# Altium project USB2JTAG.PrjPcb
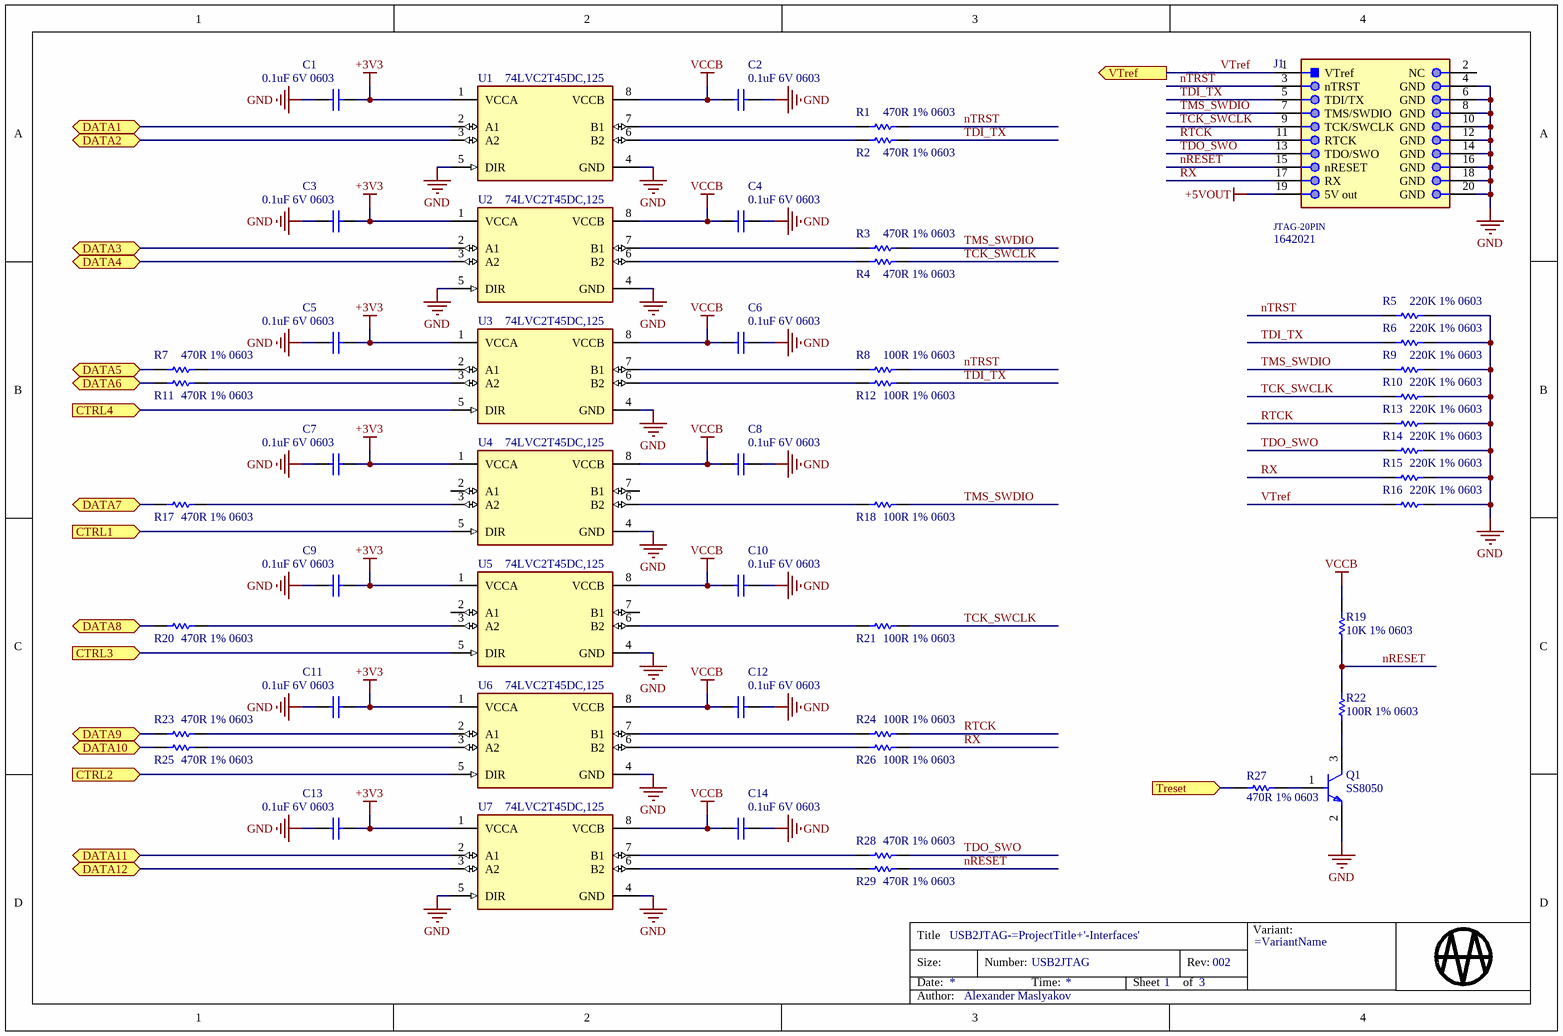
[diagram p0: USB2JTAG-Interfaces.SchDoc]
CompanyTitle: KS2Corp; PCB-SurfaceFinish: HASL; ProjectAuthor: Alexander Maslyakov; ProjectPartNumber: USB2JTAG; ProjectRevision: 002; ProjectTitle: USB2JTAG
3 sheets, 108 parts. Net scope: flat (ports and power ports of the same name join across sheets).
Board file: USB2JTAG.PcbDoc
Sheets:
  USB2JTAG-Interfaces.SchDoc
  USB2JTAG-MCU.SchDoc
  USB2JTAG-Power.SchDoc

## Sheet USB2JTAG-Interfaces.SchDoc: =ProjectTitle+'-Interfaces'
size A4; DocumentNumber: USB2JTAG; Revision: 002; SheetNumber: 1; SheetTotal: 3

### Parts
(Parts that share a designator on the sheet are numbered #1, #2 ... from top to bottom, then left to right.)
?#1  Sheet Title: USB2JTAG-=ProjectTitle+'-Interfaces'  Document Number: USB2JTAG  Revision Number: 002  Document Path and Name: Alexander Maslyakov  Total Sheets: 3  Sheet Number: 1  (hidden comment: Title Block Logo)  (graphical)
C1  0.1uF 6V 0603  [FP-GRM188-0_1-e0_2_0_55-IPC_C-NOSILK]
C2  0.1uF 6V 0603  [FP-GRM188-0_1-e0_2_0_55-IPC_C-NOSILK]
C3  0.1uF 6V 0603  [FP-GRM188-0_1-e0_2_0_55-IPC_C-NOSILK]
C4  0.1uF 6V 0603  [FP-GRM188-0_1-e0_2_0_55-IPC_C-NOSILK]
C5  0.1uF 6V 0603  [FP-GRM188-0_1-e0_2_0_55-IPC_C-NOSILK]
C6  0.1uF 6V 0603  [FP-GRM188-0_1-e0_2_0_55-IPC_C-NOSILK]
C7  0.1uF 6V 0603  [FP-GRM188-0_1-e0_2_0_55-IPC_C-NOSILK]
C8  0.1uF 6V 0603  [FP-GRM188-0_1-e0_2_0_55-IPC_C-NOSILK]
C9  0.1uF 6V 0603  [FP-GRM188-0_1-e0_2_0_55-IPC_C-NOSILK]
C10  0.1uF 6V 0603  [FP-GRM188-0_1-e0_2_0_55-IPC_C-NOSILK]
C11  0.1uF 6V 0603  [FP-GRM188-0_1-e0_2_0_55-IPC_C-NOSILK]
C12  0.1uF 6V 0603  [FP-GRM188-0_1-e0_2_0_55-IPC_C-NOSILK]
C13  0.1uF 6V 0603  [FP-GRM188-0_1-e0_2_0_55-IPC_C-NOSILK]
C14  0.1uF 6V 0603  [FP-GRM188-0_1-e0_2_0_55-IPC_C-NOSILK]
J1  JTAG-20PIN  Supplier Part Number 1: 1642021  [61202021621-Edge-SMT]
Q1  SS8050  [FP-SS8050-G-IPC_B]
R1  470R 1% 0603  [FP-ERA3A-IPC_C-NOSILK]
R2  470R 1% 0603  [FP-ERA3A-IPC_C-NOSILK]
R3  470R 1% 0603  [FP-ERA3A-IPC_C-NOSILK]
R4  470R 1% 0603  [FP-ERA3A-IPC_C-NOSILK]
R5  220K 1% 0603  [FP-ERA3A-IPC_C-NOSILK]
R6  220K 1% 0603  [FP-ERA3A-IPC_C-NOSILK]
R7  470R 1% 0603  [FP-ERA3A-IPC_C-NOSILK]
R8  100R 1% 0603  [FP-ERA3A-IPC_C-NOSILK]
R9  220K 1% 0603  [FP-ERA3A-IPC_C-NOSILK]
R10  220K 1% 0603  [FP-ERA3A-IPC_C-NOSILK]
R11  470R 1% 0603  [FP-ERA3A-IPC_C-NOSILK]
R12  100R 1% 0603  [FP-ERA3A-IPC_C-NOSILK]
R13  220K 1% 0603  [FP-ERA3A-IPC_C-NOSILK]
R14  220K 1% 0603  [FP-ERA3A-IPC_C-NOSILK]
R15  220K 1% 0603  [FP-ERA3A-IPC_C-NOSILK]
R16  220K 1% 0603  [FP-ERA3A-IPC_C-NOSILK]
R17  470R 1% 0603  [FP-ERA3A-IPC_C-NOSILK]
R18  100R 1% 0603  [FP-ERA3A-IPC_C-NOSILK]
R19  10K 1% 0603  [FP-ERA3A-IPC_C-NOSILK]
R20  470R 1% 0603  [FP-ERA3A-IPC_C-NOSILK]
R21  100R 1% 0603  [FP-ERA3A-IPC_C-NOSILK]
R22  100R 1% 0603  [FP-ERA3A-IPC_C-NOSILK]
R23  470R 1% 0603  [FP-ERA3A-IPC_C-NOSILK]
R24  100R 1% 0603  [FP-ERA3A-IPC_C-NOSILK]
R25  470R 1% 0603  [FP-ERA3A-IPC_C-NOSILK]
R26  100R 1% 0603  [FP-ERA3A-IPC_C-NOSILK]
R27  470R 1% 0603  [FP-ERA3A-IPC_C-NOSILK]
R28  470R 1% 0603  [FP-ERA3A-IPC_C-NOSILK]
R29  470R 1% 0603  [FP-ERA3A-IPC_C-NOSILK]
U1  74LVC2T45DC,125  [FP-DCU0008A-MFG]
U2  74LVC2T45DC,125  [FP-DCU0008A-MFG]
U3  74LVC2T45DC,125  [FP-DCU0008A-MFG]
U4  74LVC2T45DC,125  [FP-DCU0008A-MFG]
U5  74LVC2T45DC,125  [FP-DCU0008A-MFG]
U6  74LVC2T45DC,125  [FP-DCU0008A-MFG]
U7  74LVC2T45DC,125  [FP-DCU0008A-MFG]

### Ports
CTRL1 (in), CTRL2 (in), CTRL3 (in), CTRL4 (in), DATA1 (bidir), DATA2 (bidir), DATA3 (bidir), DATA4 (bidir), DATA5 (bidir), DATA6 (bidir), DATA7 (bidir), DATA8 (bidir), DATA9 (bidir), DATA10 (bidir), DATA11 (bidir), DATA12 (bidir), Treset (in), VTref (out)

### Nets
+3V3: C1.1 C3.1 C5.1 C7.1 C9.1 C11.1 C13.1 U1.1(VCCA) U2.1(VCCA) U3.1(VCCA) U4.1(VCCA) U5.1(VCCA) U6.1(VCCA) U7.1(VCCA)
+5VOUT: J1.19(5V_out)
GND: C1.2 C2.1 C3.2 C4.1 C5.2 C6.1 C7.2 C8.1 C9.2 C10.1 C11.2 C12.1 C13.2 C14.1 J1.4(GND) J1.6(GND) J1.8(GND) J1.10(GND) J1.12(GND) J1.14(GND) J1.16(GND) J1.18(GND) J1.20(GND) Q1.2(E) R5.2 R6.2 R9.2 R10.2 R13.2 R14.2 R15.2 R16.2 U1.4(GND) U1.5(DIR) U2.4(GND) U2.5(DIR) U3.4(GND) U4.4(GND) U5.4(GND) U6.4(GND) U7.4(GND) U7.5(DIR)
VCCB: C2.2 C4.2 C6.2 C8.2 C10.2 C12.2 C14.2 R19.1 U1.8(VCCB) U2.8(VCCB) U3.8(VCCB) U4.8(VCCB) U5.8(VCCB) U6.8(VCCB) U7.8(VCCB)
DATA1: U1.2(A1) ; port DATA1
DATA2: U1.3(A2) ; port DATA2
DATA3: U2.2(A1) ; port DATA3
DATA4: U2.3(A2) ; port DATA4
DATA5: R7.1 ; port DATA5
DATA6: R11.1 ; port DATA6
DATA7: R17.1 ; port DATA7
DATA8: R20.1 ; port DATA8
DATA9: R23.1 ; port DATA9
DATA10: R25.1 ; port DATA10
DATA11: U7.2(A1) ; port DATA11
DATA12: U7.3(A2) ; port DATA12
nRESET: J1.15(nRESET) R19.2 R22.1 R29.2
nTRST: J1.3(nTRST) R1.2 R5.1 R8.2
RTCK: J1.11(RTCK) R13.1 R24.2
RX: J1.17(RX) R15.1 R26.2
TCK_SWCLK: J1.9(TCK/SWCLK) R4.2 R10.1 R21.2
TDI_TX: J1.5(TDI/TX) R2.2 R6.1 R12.2
TDO_SWO: J1.13(TDO/SWO) R14.1 R28.2
TMS_SWDIO: J1.7(TMS/SWDIO) R3.2 R9.1 R18.2
VTref: J1.1(VTref) R16.1 ; port VTref
NetQ1_1: Q1.1(B) R27.1
NetQ1_3: Q1.3(C) R22.2
NetR1_1: R1.1 U1.7(B1)
NetR2_1: R2.1 U1.6(B2)
NetR3_1: R3.1 U2.7(B1)
NetR4_1: R4.1 U2.6(B2)
NetR7_2: R7.2 U3.2(A1)
NetR8_1: R8.1 U3.7(B1)
NetR11_2: R11.2 U3.3(A2)
NetR12_1: R12.1 U3.6(B2)
NetR17_2: R17.2 U4.3(A2)
NetR18_1: R18.1 U4.6(B2)
NetR20_2: R20.2 U5.3(A2)
NetR21_1: R21.1 U5.6(B2)
NetR23_2: R23.2 U6.2(A1)
NetR24_1: R24.1 U6.7(B1)
NetR25_2: R25.2 U6.3(A2)
NetR26_1: R26.1 U6.6(B2)
NetR27_2: R27.2 ; port Treset
NetR28_1: R28.1 U7.7(B1)
NetR29_1: R29.1 U7.6(B2)
NetU3_5: U3.5(DIR) ; port CTRL4
NetU4_5: U4.5(DIR) ; port CTRL1
NetU5_5: U5.5(DIR) ; port CTRL3
NetU6_5: U6.5(DIR) ; port CTRL2

Not connected (* = marked no-connect by the designer): J1 2(NC); U4 2(A1) 7(B1); U5 2(A1) 7(B1)

### Notes on the sheet
- Title
- Size:
- Date:
- A4
- Number:
- Time:
- Revision:
- Sheet
- of
- File:
- (in symbol Title Block MAA) Variant:; Title; Size:; Number:; Rev:; Date:; Time:; Sheet; of; Author:

### Library data of the parts
?#1 = Title Block MAA: Organization Address 1: =VariantName; Date: *; Time: *
C1-C14 = CAP0603: 50V 100nF X7R ±5% 0603 Multilayer Ceramic Capacitors MLCC - SMD/SMT ROHS; Manufacturer: Walsin Tech Corp; Manufacturer Part Number: 0603B104J500CT; Supplier 1: LCSC; Supplier Part Number 1: C119027; Case/Package: 0603
  C2: ComponentLink1Description: Datasheet; ComponentLink1URL: https://datasheet.lcsc.com/lcsc/1811151131_Walsin-Tech-Corp-0603B104J500CT_C119027.pdf
J1 = JTAG-20PIN: Male Box Header WR-BHD, THT, Vertical, pitch 2.54 mm, 20 pins; Manufacturer: Wurth Elektronik; Part Number: 61202021621; Contact Resistance: 20mOhm; Withstanding Voltage: 500VAC; Pitch: 2.54mm; Pin Number: 20; Working Voltage: 250VAC; Current Rating: 3A; Voltage Rating: 250V; Insulation Resistance: 1GR; Connector Type: Male Pin; Insulation: Insulated; Row Spacing: 0.1inch; Orientation: Vertical; Package Reference: 61202021621; Publisher: WurthElektronik; Datasheet URL: https://katalog.we-online.de/em/datasheet/6120xx21621.pdf; Operating Temperature: -40to125degC; Packaging: Tray; Mounting Technology: THT; Gender: Male; Manufacturer URL: http://www.we-online.de; Published Date: August2018; Supplier 1: Farnell; Manufacturer Part Number: 61202021621; RoHS: Yes; Category: Headers and Wire Housings; Stock 1: 1948; Pricing 1: 1=0,93000, 10=0,84200, 100=0,66700, 500=0,65400, 1000=0,64000, 2500=0,62700 (EUR); Mount: Through Hole; Contact Plating: Gold; Contact Material: Copper Alloy,Copper; Color: Black; Housing Material: PBT; Min Operating Temperature: -40°C; Max Operating Temperature: 125°C; Number of Rows: 2; Package Quantity: 160; Contact Gender: Male; Number of Positions: 20; Termination: Through Hole; Number of Contacts: 20; Series: WR-BHD; Contact Type: Male Pin; Length: 33.06mm; Width: 33.06mm; Height: 8.85mm; REACH SVHC: Unknown; Flammability Rating: UL94 V-0; RoHS Compliant: Yes; ComponentLink1URL: https://datasheet.ciiva.com/731/6120xx21621-731346.pdf?src-supplier=Digi-Key; ComponentLink1Description: https://datasheet.ciiva.com/731/6120xx21621-731346.pdf?src-supplier=Digi-Key
Q1 = CMP-20235-000001-1: 100nA 25V 300mW 1.5A 200@100mA,1V 100MHz 500mV@800mA,80mA NPN +150℃@(Tj) SOT-23(SOT-23-3) Bipolar Transistors - BJT ROHS; Manufacturer: JCST; Case/Package: SOT-23-3; Supplier 1: LCSC; Supplier Part Number 1: C2150; Manufacturer Part Number: SS8050; ComponentLink1Description: datasheet; ComponentLink1URL: https://datasheet.lcsc.com/lcsc/1811052004_Jiangsu-Changjing-Electronics-Technology-Co---Ltd--SS8050_C2150.pdf
R1-R4 R7 R11 R17 R20 R23 R25 R27-R29 = RES0603: 100mW 75V ±100ppm/℃ ±1% -55℃~+155℃ 470Ω 0603 Chip Resistor - Surface Mount ROHS; Manufacturer: YAGEO; Manufacturer Part Number: RC0603FR-07470RL; Case/Package: 0603; Supplier 1: LCSC; Supplier Part Number 1: C114669
  R1: ComponentLink1Description: Datasheet; ComponentLink1URL: https://datasheet.lcsc.com/lcsc/1810161617_YAGEO-RC0603FR-07470RL_C114669.pdf
R5 R6 R9 R10 R13-R16 = RES0603: 100mW Thick Film Resistors 75V ±100ppm/℃ ±1% -55℃~+155℃ 220kΩ 0603 Chip Resistor - Surface Mount ROHS; Manufacturer: UNI-ROYAL(Uniroyal Elec); Manufacturer Part Number: 0603WAF2203T5E; Case/Package: 0603; Supplier 1: LCSC; Supplier Part Number 1: C22961
  R5: ComponentLink1Description: Datasheet; ComponentLink1URL: https://datasheet.lcsc.com/lcsc/2206010130_UNI-ROYAL-Uniroyal-Elec-0603WAF2203T5E_C22961.pdf
R8 R12 R18 R21 R22 R24 R26 = RES0603: 100mW Thick Film Resistors 75V ±1% ±100ppm/℃ 100Ω -55℃~+155℃ 0603 Chip Resistor - Surface Mount ROHS; Manufacturer: YAGEO; Manufacturer Part Number: RC0603FR-07100RL; Case/Package: 0603; Supplier 1: LCSC; Supplier Part Number 1: C105588
  R8: ComponentLink1Description: Datasheet; ComponentLink1URL: https://datasheet.lcsc.com/lcsc/1810231425_YAGEO-RC0603FR-07100RL_C105588.pdf
R19 = RES0603: 0.1W ±1% 10kΩ 0603 Chip Resistor - Surface Mount ROHS; Manufacturer: TyoHM; Manufacturer Part Number: RMC 0603 10K F N; Case/Package: 0603; Supplier 1: LCSC; Supplier Part Number 1: C269701; ComponentLink1Description: Datasheet; ComponentLink1URL: https://datasheet.lcsc.com/lcsc/1811101830_TyoHM-RMC-0603-10K-F-N_C269701.pdf
U1-U7 = 74LVC2T45DC: 1.2V~5.5V Tri-State，Unidirectional Voltage Level Translators -40℃~+125℃ 1.2V~5.5V Bi-Directional Voltage Levels 1 2 420Mbps VSSOP-8 Translators / Level Shifters ROHS; Manufacturer: Nexperia; Manufacturer Part Number: 74LVC2T45DC,125; Supplier 1: LCSC; Supplier Part Number 1: C730237; ComponentLink1Description: Datasheet; ComponentLink1URL: https://datasheet.lcsc.com/lcsc/2201131100_Nexperia-74LVC2T45DC-125_C730237.pdf; Case/Package: VSSOP-8

## Sheet USB2JTAG-MCU.SchDoc: =ProjectTitle+'-MCU'
size A4; DocumentNumber: USB2JTAG; Revision: 002; SheetNumber: 2; SheetTotal: 3
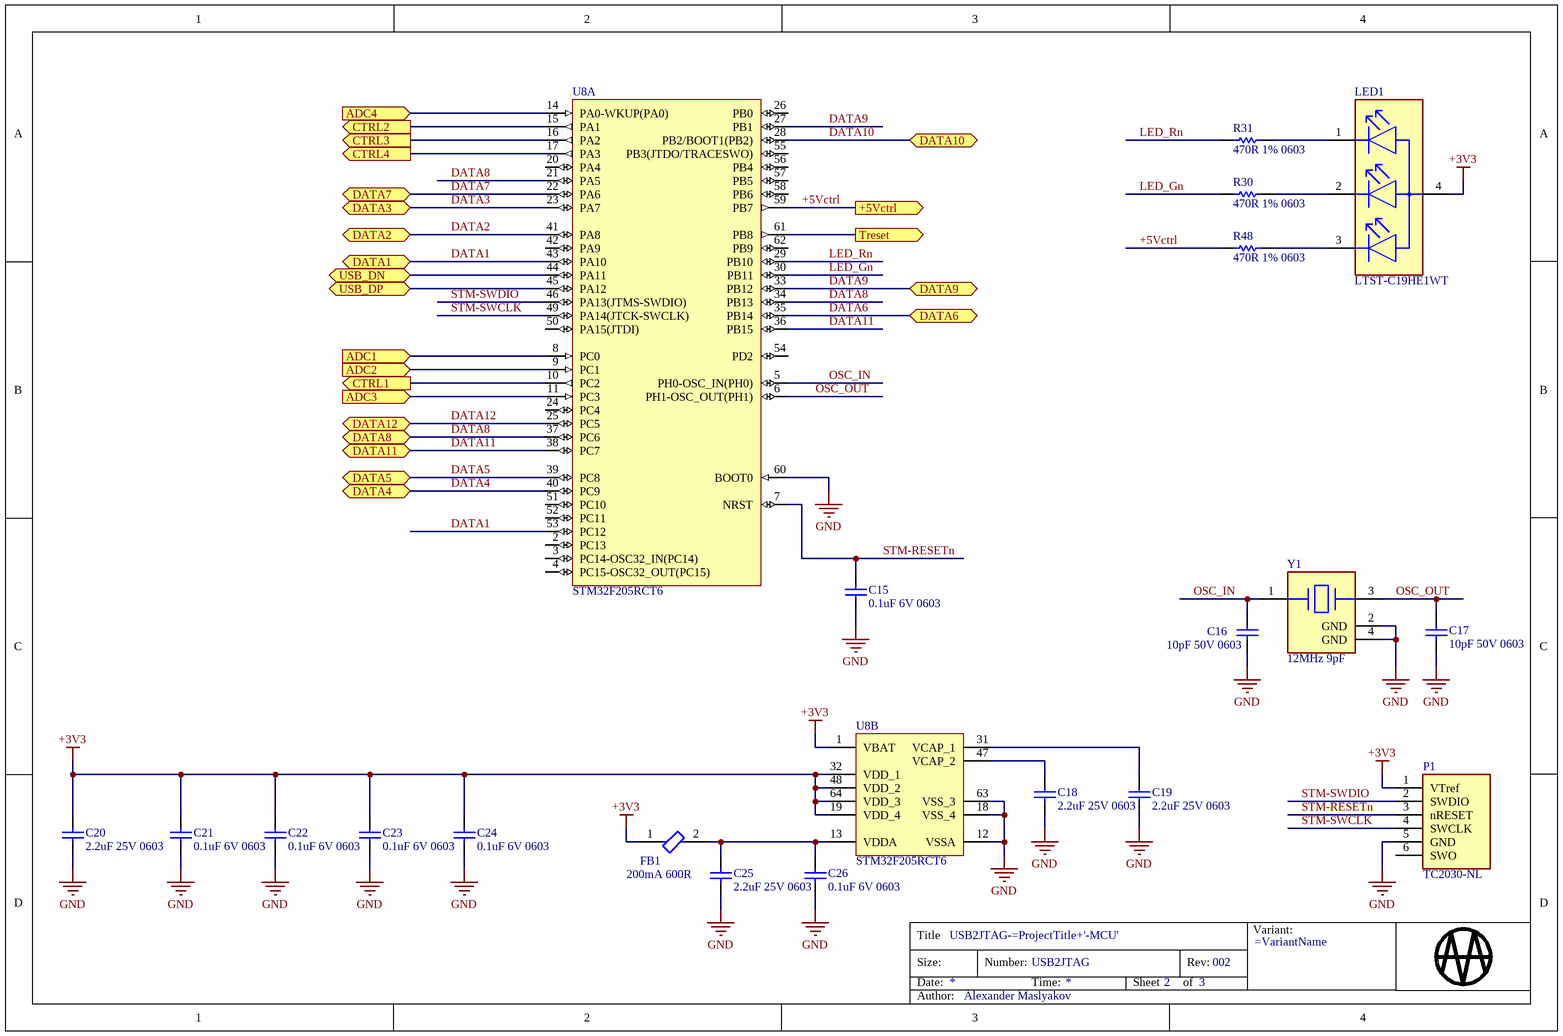
[diagram p1: USB2JTAG-MCU.SchDoc]

### Parts
(Parts that share a designator on the sheet are numbered #1, #2 ... from top to bottom, then left to right.)
?#2  Sheet Title: USB2JTAG-=ProjectTitle+'-MCU'  Document Number: USB2JTAG  Revision Number: 002  Document Path and Name: Alexander Maslyakov  Total Sheets: 3  Sheet Number: 2  (hidden comment: Title Block Logo)  (graphical)
C15  0.1uF 6V 0603  [FP-GRM188-0_1-e0_2_0_55-IPC_C-NOSILK]
C16  10pF 50V 0603  [FP-GRM188-0_1-e0_2_0_55-IPC_C-NOSILK]
C17  10pF 50V 0603  [FP-GRM188-0_1-e0_2_0_55-IPC_C-NOSILK]
C18  2.2uF 25V 0603  [FP-GRM188-0_1-e0_2_0_55-IPC_C-NOSILK]
C19  2.2uF 25V 0603  [FP-GRM188-0_1-e0_2_0_55-IPC_C-NOSILK]
C20  2.2uF 25V 0603  [FP-GRM188-0_1-e0_2_0_55-IPC_C-NOSILK]
C21  0.1uF 6V 0603  [FP-GRM188-0_1-e0_2_0_55-IPC_C-NOSILK]
C22  0.1uF 6V 0603  [FP-GRM188-0_1-e0_2_0_55-IPC_C-NOSILK]
C23  0.1uF 6V 0603  [FP-GRM188-0_1-e0_2_0_55-IPC_C-NOSILK]
C24  0.1uF 6V 0603  [FP-GRM188-0_1-e0_2_0_55-IPC_C-NOSILK]
C25  2.2uF 25V 0603  [FP-GRM188-0_1-e0_2_0_55-IPC_C-NOSILK]
C26  0.1uF 6V 0603  [FP-GRM188-0_1-e0_2_0_55-IPC_C-NOSILK]
FB1  200mA 600R  [FP-BLM18-0_15-t0_8-IPC_C]
LED1  LTST-C19HE1WT  [FP-LTST-C19HE1WT-MFG]
P1  TC2030-NL  [TC2030-NL]  (no BOM)
R30  470R 1% 0603  [FP-ERA3A-IPC_C-NOSILK]
R31  470R 1% 0603  [FP-ERA3A-IPC_C-NOSILK]
R48  470R 1% 0603  [FP-ERA3A-IPC_C-NOSILK]
U8  STM32F205RCT6  [STM-LQFP64_V]  (parts A,B of 2)
Y1  12MHz 9pF  [FP-TSX-3225-MFG]

### Ports
+5Vctrl (out), ADC1 (in), ADC2 (in), ADC3 (in), ADC4 (in), CTRL1 (out), CTRL2 (out), CTRL3 (out), CTRL4 (out), DATA1 (bidir), DATA2 (bidir), DATA3 (bidir), DATA4 (bidir), DATA5 (bidir), DATA6 (bidir), DATA7 (bidir), DATA8 (bidir), DATA9 (bidir), DATA10 (bidir), DATA11 (bidir), DATA12 (bidir), Treset (out), USB_DN (bidir), USB_DP (bidir)

### Nets
+3V3: C20.1 C21.1 C22.1 C23.1 C24.1 FB1.1 LED1.4(A) P1.1(VTref) U8.1(VBAT) U8.19(VDD_4) U8.32(VDD_1) U8.48(VDD_2) U8.64(VDD_3)
GND: C15.2 C16.2 C17.2 C18.2 C19.2 C20.2 C21.2 C22.2 C23.2 C24.2 C25.2 C26.2 P1.5(GND) U8.12(VSSA) U8.18(VSS_4) U8.60(BOOT0) U8.63(VSS_3) Y1.2(GND) Y1.4(GND)
+5Vctrl: R48.1 U8.59(PB7) ; port +5Vctrl
DATA1: U8.43(PA10) U8.53(PC12) ; port DATA1
DATA2: U8.41(PA8) ; port DATA2
DATA3: U8.23(PA7) ; port DATA3
DATA4: U8.40(PC9) ; port DATA4
DATA5: U8.39(PC8) ; port DATA5
DATA6: U8.35(PB14) ; port DATA6
DATA7: U8.22(PA6) ; port DATA7
DATA8: U8.21(PA5) U8.34(PB13) U8.37(PC6) ; port DATA8
DATA9: U8.27(PB1) U8.33(PB12) ; port DATA9
DATA10: U8.28(PB2/BOOT1(PB2)) ; port DATA10
DATA11: U8.36(PB15) U8.38(PC7) ; port DATA11
DATA12: U8.25(PC5) ; port DATA12
LED_Gn: R30.1 U8.30(PB11)
LED_Rn: R31.1 U8.29(PB10)
OSC_IN: C16.1 U8.5(PH0-OSC_IN(PH0)) Y1.1
OSC_OUT: C17.1 U8.6(PH1-OSC_OUT(PH1)) Y1.3
STM-RESETn: C15.1 P1.3(nRESET) U8.7(NRST)
STM-SWCLK: P1.4(SWCLK) U8.49(PA14(JTCK-SWCLK))
STM-SWDIO: P1.2(SWDIO) U8.46(PA13(JTMS-SWDIO))
USB_D_N: U8.44(PA11) ; port USB_DN
USB_D_P: U8.45(PA12) ; port USB_DP
NetC18_1: C18.1 U8.47(VCAP_2)
NetC19_1: C19.1 U8.31(VCAP_1)
NetC25_1: C25.1 C26.1 FB1.2 U8.13(VDDA)
NetC30_1: U8.8(PC0) ; port ADC1
NetC31_1: U8.11(PC3) ; port ADC3
NetC32_1: U8.14(PA0-WKUP(PA0)) ; port ADC4
NetC34_1: U8.9(PC1) ; port ADC2
NetLED1_1: LED1.1(RED_C) R31.2
NetLED1_2: LED1.2(GREEN_C) R30.2
NetLED1_3: LED1.3(BLUE_C) R48.2
NetR27_2: U8.61(PB8) ; port Treset
NetU3_5: U8.17(PA3) ; port CTRL4
NetU4_5: U8.10(PC2) ; port CTRL1
NetU5_5: U8.16(PA2) ; port CTRL3
NetU6_5: U8.15(PA1) ; port CTRL2

Not connected (* = marked no-connect by the designer): P1 6(SWO); U8 2(PC13) 3(PC14-OSC32_IN(PC14)) 4(PC15-OSC32_OUT(PC15)) 20(PA4) 24(PC4) 26(PB0) 42(PA9) 50(PA15(JTDI)) 51(PC10) 52(PC11) 54(PD2) 55(PB3(JTDO/TRACESWO)) 56(PB4) 57(PB5) 58(PB6) 62(PB9)

### Notes on the sheet
- Title
- Size:
- Date:
- A4
- Number:
- Time:
- Revision:
- Sheet
- of
- File:
- (in symbol Title Block MAA) Variant:; Title; Size:; Number:; Rev:; Date:; Time:; Sheet; of; Author:

### Library data of the parts
?#2 = Title Block MAA: Organization Address 1: =VariantName; Date: *; Time: *
C15 C21-C24 C26 = CAP0603: as C1 on sheet USB2JTAG-Interfaces; Supplier 1: LCSC; Supplier Part Number 1: C119027; Case/Package: 0603
  C26: ComponentLink1Description: Datasheet; ComponentLink1URL: https://datasheet.lcsc.com/lcsc/1811151131_Walsin-Tech-Corp-0603B104J500CT_C119027.pdf
C16 C17 = CAP0603: 50V 10pF C0G ±5% 0603 Multilayer Ceramic Capacitors MLCC - SMD/SMT ROHS; Manufacturer: FH(Guangdong Fenghua Advanced Tech); Manufacturer Part Number: 0603CG100J500NT; Supplier 1: LCSC; Supplier Part Number 1: C91367; Case/Package: 0603
  C16: ComponentLink1Description: Datasheet; ComponentLink1URL: https://datasheet.lcsc.com/lcsc/1811061814_FH-Guangdong-Fenghua-Advanced-Tech-0603CG100J500NT_C91367.pdf
C18-C20 C25 = CAP0603: 25V 2.2uF X7R ±10% 0603 Multilayer Ceramic Capacitors MLCC - SMD/SMT ROHS; Manufacturer: FH(Guangdong Fenghua Advanced Tech); Manufacturer Part Number: 0603B225K250NT; Supplier 1: LCSC; Supplier Part Number 1: C99228; Case/Package: 0603
  C18 C25: ComponentLink1Description: Datasheet; ComponentLink1URL: https://datasheet.lcsc.com/lcsc/1810101210_FH-Guangdong-Fenghua-Advanced-Tech-0603B225K250NT_C99228.pdf
FB1 = CMP-0686-00557-7: 200mA 1 450mΩ 600Ω@100MHz ±25% 0603 Ferrite Beads ROHS; Manufacturer: Sunlord; Manufacturer Part Number: GZ1608D601TF; Supplier 1: LCSC; Supplier Part Number 1: C1002; Case/Package: 0603; ComponentLink1Description: Datasheet; ComponentLink1URL: https://datasheet.lcsc.com/lcsc/2109180930_Sunlord-GZ1608D601TF_C1002.pdf
LED1 = CMP-2000-05201-2: LED RGB DIFFUSED CHIP SMD; Manufacturer: Vishay Lite-On; Number of LEDs: 3; Test Current: 20mA; Luminous Intensity: 180mcd; Lens Color: White; Dominant Wavelength: 470nm; Color: Blue; Reverse Voltage: 5V; Viewing Angle: 130°; Forward Voltage: 3.35V; Max Operating Temperature: 80°C; Packaging: Tape and Reel; Lens Transparency: Diffused; Width: 1.6mm; Case Code (Metric): 1616; Height: 0.35mm; Lens Style: Diffused; Mount: Surface Mount; Package Quantity: 3000; Radiation Hardening: No; Length: 1.6mm; Case/Package: 0606; Forward Current: 20mA; Case Code (Imperial): 0606; Lead Free: Lead Free; Min Operating Temperature: -20°C; Number of Elements: 3; Number of Pins: 4; Depth: 1.6mm; Supplier 1: Rs; Supplier Part Number 1: C458749; Manufacturer Part Number: LTST-C19HE1WT; RoHS: Yes; Category: LEDs; Stock 1: 9250; Pricing 1: 5=138,483, 10=79,328 (RUB); Series: -; RoHS Compliant: Yes; ComponentLink1URL: https://datasheet.ciiva.com/41805/s-110-ltst-c19he1wt-41805918.pdf?src-supplier=Digi-Key; ComponentLink1Description: https://datasheet.ciiva.com/41805/s-110-ltst-c19he1wt-41805918.pdf?src-supplier=Digi-Key; ComponentLink2URL: https://datasheet.ciiva.com/11773/0900766b80dc0566-11773828.pdf?src-supplier=Rs; ComponentLink2Description: https://datasheet.ciiva.com/11773/0900766b80dc0566-11773828.pdf?src-supplier=Rs
R30 R31 R48 = RES0603: as R1 on sheet USB2JTAG-Interfaces; Case/Package: 0603; Supplier 1: LCSC; Supplier Part Number 1: C114669
U8 = STM32F205RCT6: High-performance ARM Cortex-M3 MCU with 256 Kbytes Flash, 120 MHz CPU, ART Accelerator; Manufacturer: STMicroelectronics; RAM Size: 100KB; Max Power Dissipation: 444mW; Interface: SDIO,I2C,SPI,USB,CAN,IrDA,MMC,UART,USART,LIN,I2S; Number of I/Os: 51; Number of Timers/Counters: 14; Max Supply Voltage: 3.6V; Frequency: 120MHz; Min Supply Voltage: 1.8V; Number of Programmable I/O: 16; Data Bus Width: 32b; Oscillator Type: Internal; Watchdog Timer: Yes; Memory Size: 256KB; Peripherals: Brown-out Detect/Reset,POR,PWM,WDT,DMA,LCD,I2C; Number of PWM Channels: 2; Number of SPI Channels: 3; Number of Ethernet Channels: 1; ComponentLink2URL: http://www.st.com/st-web-ui/static/active/en/resource/technical/document/datasheet/CD00237391.pdf; ComponentLink3Description: Package Specification; ComponentLink2Description: Datasheet; ComponentLink1Description: Manufacturer URL; ComponentLink3URL: http://www.st.com/st-web-ui/static/active/en/resource/technical/document/datasheet/DM00037051.pdf; ComponentLink1URL: http://www.st.com/web/en/home.html; Supplier 1: RSComponents; Manufacturer Part Number: STM32F205RCT6; RoHS: Yes; Category: Microcontrollers; Stock 1: 3; Pricing 1: 5=12,81000, 10=11,58000, 25=11,05600, 100=9,59400, 250=9,13400 (GBP); Case/Package: LQFP; Number of Pins: 64; Min Operating Temperature: -40°C; Max Operating Temperature: 85°C; Packaging: Tray; Max Frequency: 120MHz; Memory Type: FLASH; Core Architecture: ARM; Package Quantity: 160; Number of USB Channels: 2; Number of ADC Channels: 16; Number of I2C Channels: 3; Number of UART Channels: 2; Length: 10.2mm; Width: 10.2mm; Height: 1.45mm; Radiation Hardening: No; REACH SVHC: No SVHC; Lead Free: Lead Free; ComponentLink4URL: https://datasheet.ciiva.com/8055/1776949-8055000.pdf?src-supplier=Element14; ComponentLink4Description: https://datasheet.ciiva.com/8055/1776949-8055000.pdf?src-supplier=Element14; ComponentLink5URL: https://datasheet.ciiva.com/16491/cd00237391-16491001.pdf?src-supplier=Future+Electronics; ComponentLink5Description: https://datasheet.ciiva.com/16491/cd00237391-16491001.pdf?src-supplier=Future+Electronics; ComponentLink6URL: https://datasheet.ciiva.com/48687/001075498-da-01-en-mcu-256kb-stm32f205rct6-lqfp-64-stm-48687468.pdf?src-supplier=Conrad; ComponentLink6Description: https://datasheet.ciiva.com/48687/001075498-da-01-en-mcu-256kb-stm32f205rct6-lqfp-64-stm-48687468.pdf?src-supplier=Conrad; Supplier Part Number 1: 7958647
Y1 = CMP-36405-000013-1: SMD3225-4P Crystals ROHS; Manufacturer: TAE(Zhejiang Abel Elec); Manufacturer Part Number: TXM12M0004322CBCDO00T; ESR (Equivalent Series Resistance): 60R; Load Capacitance: 9pF; Frequency: 12MHz; Case/Package: SMD3225-4P; Supplier 1: LCSC; Supplier Part Number 1: C362368; Category: Crystals; ComponentLink1Description: Datasheet; ComponentLink1URL: https://datasheet.lcsc.com/lcsc/1912111437_TAE-Zhejiang-Abel-Elec-TXM12M0004322CBCDO00T_C362368.pdf

## Sheet USB2JTAG-Power.SchDoc: =ProjectTitle+'-Power'
size A4; DocumentNumber: USB2JTAG; Revision: 002; SheetNumber: 3; SheetTotal: 3
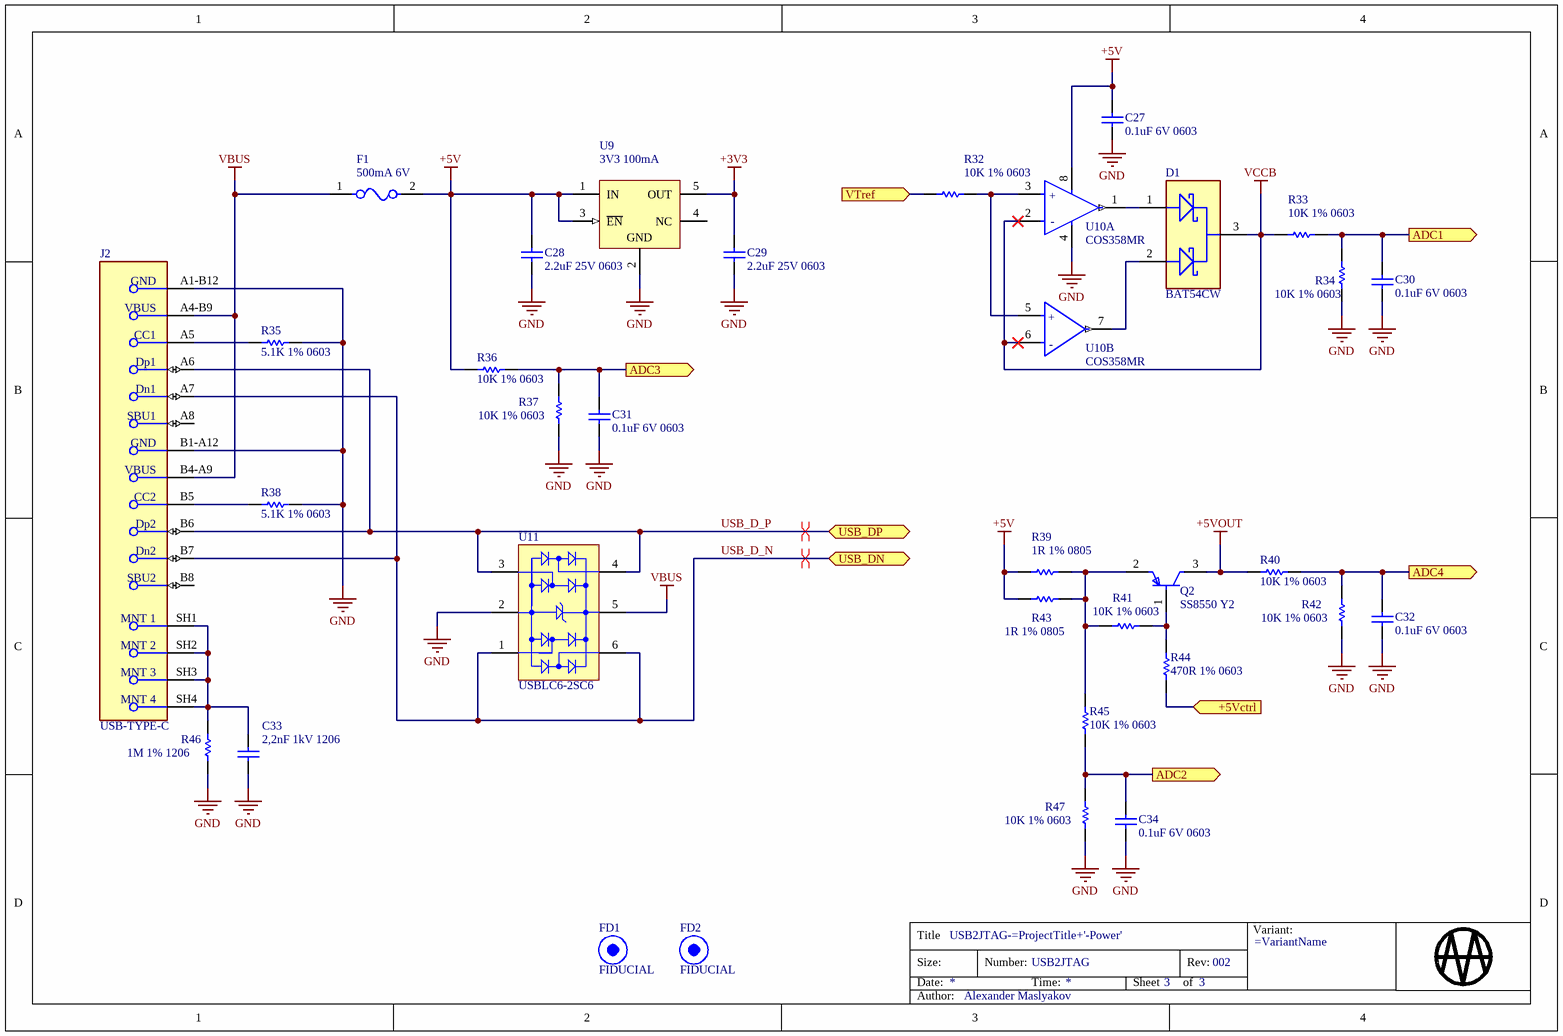
[diagram p2: USB2JTAG-Power.SchDoc]

### Parts
(Parts that share a designator on the sheet are numbered #1, #2 ... from top to bottom, then left to right.)
?#3  Sheet Title: USB2JTAG-=ProjectTitle+'-Power'  Document Number: USB2JTAG  Revision Number: 002  Document Path and Name: Alexander Maslyakov  Total Sheets: 3  (hidden comment: Title Block Logo)  (graphical)
C27  0.1uF 6V 0603  [FP-GRM188-0_1-e0_2_0_55-IPC_C-NOSILK]
C28  2.2uF 25V 0603  [FP-GRM188-0_1-e0_2_0_55-IPC_C-NOSILK]
C29  2.2uF 25V 0603  [FP-GRM188-0_1-e0_2_0_55-IPC_C-NOSILK]
C30  0.1uF 6V 0603  [FP-GRM188-0_1-e0_2_0_55-IPC_C-NOSILK]
C31  0.1uF 6V 0603  [FP-GRM188-0_1-e0_2_0_55-IPC_C-NOSILK]
C32  0.1uF 6V 0603  [FP-GRM188-0_1-e0_2_0_55-IPC_C-NOSILK]
C33  2,2nF 1kV 1206  [FP-C3216-160-0_2-IPC_B-NOSILK]
C34  0.1uF 6V 0603  [FP-GRM188-0_1-e0_2_0_55-IPC_C-NOSILK]
D1  BAT54CW  [FP-SOT323-IPC_B]
F1  500mA 6V  [FP-0805L-MFG]
FD1  FIDUCIAL  [FIDUCIAL_2MM]  (no BOM)
FD2  FIDUCIAL  [FIDUCIAL_2MM]  (no BOM)
J2  USB-TYPE-C  [KH-TYPE-C-16P-2]
Q2  SS8550 Y2  [FP-SOT-23-IPC_B]
R32  10K 1% 0603  [FP-ERA3A-IPC_C-NOSILK]
R33  10K 1% 0603  [FP-ERA3A-IPC_C-NOSILK]
R34  10K 1% 0603  [FP-ERA3A-IPC_C-NOSILK]
R35  5.1K 1% 0603  [FP-ERA3A-IPC_C-NOSILK]
R36  10K 1% 0603  [FP-ERA3A-IPC_C-NOSILK]
R37  10K 1% 0603  [FP-ERA3A-IPC_C-NOSILK]
R38  5.1K 1% 0603  [FP-ERA3A-IPC_C-NOSILK]
R39  1R 1% 0805  [FP-RC0805-0_6-IPC_B-NOSILK]
R40  10K 1% 0603  [FP-ERA3A-IPC_C-NOSILK]
R41  10K 1% 0603  [FP-ERA3A-IPC_C-NOSILK]
R42  10K 1% 0603  [FP-ERA3A-IPC_C-NOSILK]
R43  1R 1% 0805  [FP-RC0805-0_6-IPC_B-NOSILK]
R44  470R 1% 0603  [FP-ERA3A-IPC_C-NOSILK]
R45  10K 1% 0603  [FP-ERA3A-IPC_C-NOSILK]
R46  1M 1% 1206  [FP-RC1206-IPC_B]
R47  10K 1% 0603  [FP-ERA3A-IPC_C-NOSILK]
U9  3V3 100mA  [DBV0005A_N]
U10  COS358MR  [MSOP-8]  (parts A,B of 2)
U11  USBLC6-2SC6  [STM-SOT23-6L_V]

### Ports
+5Vctrl (in), ADC1 (out), ADC2 (out), ADC3 (out), ADC4 (out), USB_DN (bidir), USB_DP (bidir), VTref (in)

### Nets
+3V3: C29.1 U9.5(OUT)
+5V: C27.1 C28.1 F1.2 R36.2 R39.2 R43.2 U9.1(IN) U9.3(~{EN}) U10.8(V+)
+5VOUT: Q2.3(C) R40.2
GND: C27.2 C28.2 C29.2 C30.2 C31.2 C32.2 C33.2 C34.2 J2.A1-B12(GND) J2.B1-A12(GND) R34.2 R35.1 R37.2 R38.1 R42.2 R46.2 R47.2 U9.2(GND) U10.4(V-) U11.2(GND)
VBUS: F1.1 J2.A4-B9(VBUS) J2.B4-A9(VBUS) U11.5(VBUS)
VCCB: D1.3(COMMON_CATHODE) R33.2 U10.2(IN1-) U10.6(IN2-)
+5Vctrl: R44.1 ; port +5Vctrl
USB_D_N: J2.A7(Dn1) J2.B7(Dn2) U11.1(I/O_1) U11.6(I/O_4) ; port USB_DN
USB_D_P: J2.A6(Dp1) J2.B6(Dp2) U11.3(I/O_2) U11.4(I/O_3) ; port USB_DP
VTref: R32.2 ; port VTref
NetC30_1: C30.1 R33.1 R34.1 ; port ADC1
NetC31_1: C31.1 R36.1 R37.1 ; port ADC3
NetC32_1: C32.1 R40.1 R42.1 ; port ADC4
NetC33_1: C33.1 J2.SH1 J2.SH2 J2.SH3 J2.SH4 R46.1
NetC34_1: C34.1 R45.1 R47.1 ; port ADC2
NetD1_1: D1.1(1_ANODE) U10.1(OUT1)
NetD1_2: D1.2(2_ANODE) U10.7(OUT2)
NetJ2_A5: J2.A5(CC1) R35.2
NetJ2_B5: J2.B5(CC2) R38.2
NetQ2_1: Q2.1(B) R41.2 R44.2
NetQ2_2: Q2.2(E) R39.1 R41.1 R43.1 R45.2
NetR32_1: R32.1 U10.3(IN1+) U10.5(IN2+)

Not connected (* = marked no-connect by the designer): J2 A8(SBU1) B8(SBU2); U9 4(NC)

### Layout directives
differential pair: USB_D_N, USB_D_P

### Notes on the sheet
- Title
- Size:
- Date:
- A4
- Number:
- Time:
- Revision:
- Sheet
- of
- File:
- (in symbol OPAMP 2 CIRCUIT, part A) +; -
- (in symbol OPAMP 2 CIRCUIT, part B) +; -
- (in symbol Title Block MAA) Variant:; Title; Size:; Number:; Rev:; Date:; Time:; Sheet; of; Author:
- (in symbol USB-TYPE-C) MNT 1; MNT 2; MNT 3; MNT 4

### Library data of the parts
?#3 = Title Block MAA: Organization Address 1: =VariantName; Date: *; Time: *; Sheet Number: 3
C27 C30-C32 C34 = CAP0603: as C1 on sheet USB2JTAG-Interfaces; Supplier 1: LCSC; Supplier Part Number 1: C119027; Case/Package: 0603
C28 C29 = CAP0603: as C18 on sheet USB2JTAG-MCU; Supplier 1: LCSC; Supplier Part Number 1: C99228; Case/Package: 0603
  C28: ComponentLink1Description: Datasheet; ComponentLink1URL: *
C33 = CAP1206: 1kV 2.2nF X7R ±10% 1206  Multilayer Ceramic Capacitors MLCC - SMD/SMT ROHS; Manufacturer: FH (Guangdong Fenghua Advanced Tech); Manufacturer Part Number: 1206B222K102NT; Supplier 1: LCSC; Supplier Part Number 1: C9191; Case/Package: 1206; ComponentLink1Description: Datasheet; ComponentLink1URL: https://datasheet.lcsc.com/lcsc/1811151146_FH--Guangdong-Fenghua-Advanced-Tech-1206B222K102NT_C9191.pdf
D1 = CMP-12790-000028-1: 30V 1V@100mA 200mA SOT-323(SC-70) Schottky Barrier Diodes (SBD) ROHS; Manufacturer: Jiangsu Changjing Electronics Technology Co., Ltd.; Manufacturer Part Number: BAT54CW; Supplier 1: LCSC; Supplier Part Number 1: C77321; Case/Package: SOT-323; ComponentLink1Description: Datasheet; ComponentLink1URL: https://datasheet.lcsc.com/lcsc/1811122015_Jiangsu-Changjing-Electronics-Technology-Co---Ltd--BAT54CW_C77321.pdf
F1 = CMP-08606-000023-1: 6V 500mA 100A 1A 100ms 0805 Resettable Fuses ROHS; Manufacturer Part Number: SMD0805B050TF; Manufacturer: Brightking; Supplier 1: LCSC; Supplier Part Number 1: C269104; Case/Package: 0805; ComponentLink1Description: Datasheet; ComponentLink1URL: https://datasheet.lcsc.com/lcsc/1808280424_Brightking-SMD0805B050TF_C269104.pdf
J2 = USB-TYPE-C: CONN USB 2.0 TYPE-C R/A SMT; Manufacturer: Shenzhen Kinghelm Elec; Manufacturer Part Number: KH-TYPE-C-16P; Number Of Contacts: 16; ComponentLink2URL: https://datasheet.lcsc.com/lcsc/2009111434_Shenzhen-Kinghelm-Elec-KH-TYPE-C-16P_C709357.pdf; ComponentLink2Description: Datasheet; Supplier 1: LCSC; Supplier Part Number 1: C709357
Q2 = CMP-56214-000002-1: 100nA 25V 300mW 1.5A 200@100mA,1V 100MHz 500mV@800mA,80mA PNP +150℃@(Tj) SOT-23(SOT-23-3) Bipolar Transistors - BJT ROHS; Manufacturer: JCST; Case/Package: SOT-23; Supplier 1: LCSC; Supplier Part Number 1: C8542; Manufacturer Part Number: SS8550 Y2; ComponentLink1Description: datasheet; ComponentLink1URL: https://datasheet.lcsc.com/lcsc/1810161212_Jiangsu-Changjing-Electronics-Technology-Co---Ltd--SS8550-Y2_C8542.pdf
R32-R34 R36 R37 R40-R42 R45 R47 = RES0603: as R19 on sheet USB2JTAG-Interfaces; Case/Package: 0603; Supplier 1: LCSC; Supplier Part Number 1: C269701
  R34 R41: ComponentLink1Description: Datasheet; ComponentLink1URL: https://datasheet.lcsc.com/lcsc/1811101830_TyoHM-RMC-0603-10K-F-N_C269701.pdf
R35 R38 = RES0603: 100mW Thick Film Resistors 75V ±1% ±100ppm/℃ 5.1kΩ -55℃~+155℃ 0603 Chip Resistor - Surface Mount ROHS; Manufacturer: YAGEO; Manufacturer Part Number: RC0603FR-075K1L; Case/Package: 0603; Supplier 1: LCSC; Supplier Part Number 1: C105580
  R38: ComponentLink1Description: Datasheet; ComponentLink1URL: https://datasheet.lcsc.com/lcsc/1808272258_YAGEO-RC0603FR-075K1L_C105580.pdf
R39 R43 = RES0805: 125mW Thick Film Resistors 150V ±1% ±400ppm/℃ -55℃~+155℃ 1Ω 0805 Chip Resistor - Surface Mount ROHS; Manufacturer Part Number: 0805W8F100KT5E; Manufacturer: UNI-ROYAL(Uniroyal Elec); Supplier 1: LCSC; Supplier Part Number 1: C25271; Case/Package: 0805
  R39: ComponentLink1Description: Datasheet; ComponentLink1URL: https://datasheet.lcsc.com/lcsc/2205311845_UNI-ROYAL-Uniroyal-Elec-0805W8F100KT5E_C25271.pdf
R44 = RES0603: as R1 on sheet USB2JTAG-Interfaces; Case/Package: 0603; Supplier 1: LCSC; Supplier Part Number 1: C114669; ComponentLink1Description: Datasheet; ComponentLink1URL: https://datasheet.lcsc.com/lcsc/1810161617_YAGEO-RC0603FR-07470RL_C114669.pdf
R46 = RES1206: 250mW Thick Film Resistors 200V ±1% ±100ppm/℃ -55℃~+155℃ 1MΩ 1206 Chip Resistor - Surface Mount ROHS; Manufacturer: YAGEO; Manufacturer Part Number: RC1206FR-071ML; Supplier 1: LCSC; Supplier Part Number 1: C108083; Case/Package: 1206; ComponentLink1Description: Datasheet; ComponentLink1URL: https://datasheet.lcsc.com/lcsc/1808272252_YAGEO-RC1206FR-071ML_C108083.pdf
U9 = CMP-0394-00641-2: 350mA 320mV@(200mA) Fixed 3.3V~3.3V Positive 1 18V SOT-23-5 Linear Voltage Regulators (LDO) ROHS; Manufacturer: MICRONE(Nanjing Micro One Elec); Manufacturer Part Number: ME6215C33M5G; ComponentLink2URL: https://datasheet.lcsc.com/lcsc/1809201023_MICRONE-Nanjing-Micro-One-Elec-ME6215C33M5G_C84119.pdf; ComponentLink2Description: datasheet; Supplier 1: LCSC; Supplier Part Number 1: C84119; Case/Package: SOT-23-5
U10 = OPAMP 2 CIRCUIT: IC OPAMP GP 2 CIRCUIT 8SOIC; Manufacturer: COSINE; Case/Package: MSOP-8; Manufacturer Part Number: COS358MR; Supplier 1: LCSC; Supplier Part Number 1: C693058; ComponentLink1Description: Datasheet; ComponentLink1URL: https://datasheet.lcsc.com/lcsc/2006301914_COSINE-COS358MR_C693058.pdf
U11 = CMP-2000-05378-1: Very low capacitance ESD protection, 3.5 pF, -40 to 125 degC, 6-Pin SOT23, RoHS, Tape and Reel; Manufacturer: STMicroelectronics; Polarity: Uni-Directional; Clamping Voltage: 17V; Rad Hardened: No; Product Height (mm): 1.3mm; Leakage Current (Max): 0.15uA; Product Length (mm): 3.05mm; Number of Elements: 1; Peak Pulse Current: 5A; Configuration: Dual; Reverse Breakdown Voltage: 6V; Working Voltage (Max): 5V; Capacitance Value: 3.5pF; Suppressor Type: DiodeArrays; Product Depth (mm): 1.75mm; Test Current (It): 1mA; Direction: Unidirectional,Bidirectional; Operating Supply Voltage: 1.1V; Number of Channels: 2; Reverse Standoff Voltage: 5.25V; Power Line Protection: Yes; Max Reverse Leakage Current: 150nA; Data Rate: 480Mbps; Package / Case: SOT-23; Operating Temperature Max Deg. C: 125C; Package Description: 6-Pin Small Outline Transistor, Body 2.925 x 1.625 mm, Pitch 0.95 mm; Package Reference: SOT23-6L; Datasheet Version: Rev. 5, 10/2011; Operating Temperature Min Deg. C: -40C; Mounting Style: SurfaceMount; Direction Type: Uni-Directional; Mounting: SurfaceMount; Pin Count: 6; Leakage Current: 0.15uA; Packaging: TapeandReel; Operating Temperature Classification: Automotive; Clamping Voltage (Max): 17V; Manufacturer URL: http://www.st.com/; Reverse Stand-off Voltage: 5V; Datasheet URL: http://www.st.com/st-web-ui/static/active/en/resource/technical/document/datasheet/CD00050750.pdf; Working Voltage: 5V; Operating Temp Range: -40Cto125C; Supplier 1: Rs; Manufacturer Part Number: USBLC6-2SC6; RoHS: Yes; Category: TVS Diodes; Stock 1: 6950; Pricing 1: 10=101,409, 50=95,548, 100=90,505, 250=85,325, 500=81,1 (RUB); Mount: Surface Mount; Case/Package: SOT-23; Number of Pins: 6; Min Operating Temperature: -40°C; Max Operating Temperature: 125°C; Capacitance: 3.5pF; Termination: SMD/SMT; Series: USB; Package Quantity: 3000; Breakdown Voltage: 6V; Number of Bidirectional Channels: 2; Min Breakdown Voltage: 6V; ESD Protection: Yes; Test Current: 1mA; Max Breakdown Voltage: 6V; Clamping Voltage-Max: 17V; Length: 3.05mm; Width: 1.75mm; Height: 1.3mm; Depth: 1.75mm; Radiation Hardening: No; Reach SVHC Compliant: No; Lead Free: Lead Free; RoHS Compliant: Yes; ComponentLink1URL: https://datasheet.ciiva.com/1268/1690354-1268384.pdf?src-supplier=Element14; ComponentLink1Description: https://datasheet.ciiva.com/1268/1690354-1268384.pdf?src-supplier=Element14; ComponentLink2URL: https://datasheet.ciiva.com/4508/cd00050750-113117-4508433.pdf?src-supplier=Mouser; ComponentLink2Description: https://datasheet.ciiva.com/4508/cd00050750-113117-4508433.pdf?src-supplier=Mouser; ComponentLink3URL: https://datasheet.ciiva.com/15143/getdatasheetpartid-148465-15143789.pdf?src-supplier=Verical; ComponentLink3Description: https://datasheet.ciiva.com/15143/getdatasheetpartid-148465-15143789.pdf?src-supplier=Verical; ComponentLink4URL: https://datasheet.ciiva.com/16200/cd00050750-16200026.pdf?src-supplier=Future+Electronics; ComponentLink4Description: https://datasheet.ciiva.com/16200/cd00050750-16200026.pdf?src-supplier=Future+Electronics; ComponentLink5URL: https://datasheet.ciiva.com/41444/001184109-da-01-en-ic-esd-protecti-usblc6-2sc6-sot-23-6-stm-41444156.pdf?src-supplier=Conrad; ComponentLink5Description: https://datasheet.ciiva.com/41444/001184109-da-01-en-ic-esd-protecti-usblc6-2sc6-sot-23-6-stm-41444156.pdf?src-supplier=Conrad; Supplier Part Number 1: C5250994

## Nets that join several sheets
+3V3: USB2JTAG-Interfaces (14 pins), USB2JTAG-MCU (13 pins), USB2JTAG-Power (C29.1 U9.5)
+5VOUT: USB2JTAG-Interfaces (J1.19), USB2JTAG-Power (Q2.3 R40.2)
GND: USB2JTAG-Interfaces (42 pins), USB2JTAG-MCU (19 pins), USB2JTAG-Power (20 pins)
VCCB: USB2JTAG-Interfaces (15 pins), USB2JTAG-Power (D1.3 R33.2 U10.2 U10.6)
+5Vctrl: USB2JTAG-MCU (R48.1 U8.59), USB2JTAG-Power (R44.1)
DATA1: USB2JTAG-Interfaces (U1.2), USB2JTAG-MCU (U8.43 U8.53)
DATA2: USB2JTAG-Interfaces (U1.3), USB2JTAG-MCU (U8.41)
DATA3: USB2JTAG-Interfaces (U2.2), USB2JTAG-MCU (U8.23)
DATA4: USB2JTAG-Interfaces (U2.3), USB2JTAG-MCU (U8.40)
DATA5: USB2JTAG-Interfaces (R7.1), USB2JTAG-MCU (U8.39)
DATA6: USB2JTAG-Interfaces (R11.1), USB2JTAG-MCU (U8.35)
DATA7: USB2JTAG-Interfaces (R17.1), USB2JTAG-MCU (U8.22)
DATA8: USB2JTAG-Interfaces (R20.1), USB2JTAG-MCU (U8.21 U8.34 U8.37)
DATA9: USB2JTAG-Interfaces (R23.1), USB2JTAG-MCU (U8.27 U8.33)
DATA10: USB2JTAG-Interfaces (R25.1), USB2JTAG-MCU (U8.28)
DATA11: USB2JTAG-Interfaces (U7.2), USB2JTAG-MCU (U8.36 U8.38)
DATA12: USB2JTAG-Interfaces (U7.3), USB2JTAG-MCU (U8.25)
NetC30_1: USB2JTAG-MCU (U8.8), USB2JTAG-Power (C30.1 R33.1 R34.1)
NetC31_1: USB2JTAG-MCU (U8.11), USB2JTAG-Power (C31.1 R36.1 R37.1)
NetC32_1: USB2JTAG-MCU (U8.14), USB2JTAG-Power (C32.1 R40.1 R42.1)
NetC34_1: USB2JTAG-MCU (U8.9), USB2JTAG-Power (C34.1 R45.1 R47.1)
NetR27_2: USB2JTAG-Interfaces (R27.2), USB2JTAG-MCU (U8.61)
NetU3_5: USB2JTAG-Interfaces (U3.5), USB2JTAG-MCU (U8.17)
NetU4_5: USB2JTAG-Interfaces (U4.5), USB2JTAG-MCU (U8.10)
NetU5_5: USB2JTAG-Interfaces (U5.5), USB2JTAG-MCU (U8.16)
NetU6_5: USB2JTAG-Interfaces (U6.5), USB2JTAG-MCU (U8.15)
USB_D_N: USB2JTAG-MCU (U8.44), USB2JTAG-Power (J2.A7 J2.B7 U11.1 U11.6)
USB_D_P: USB2JTAG-MCU (U8.45), USB2JTAG-Power (J2.A6 J2.B6 U11.3 U11.4)
VTref: USB2JTAG-Interfaces (J1.1 R16.1), USB2JTAG-Power (R32.2)

## Assembly variants
JLCPCB: not fitted J1 P1 U8
Full: all parts fitted